# EAGLE design rev10 (EAGLE 7.5.0)
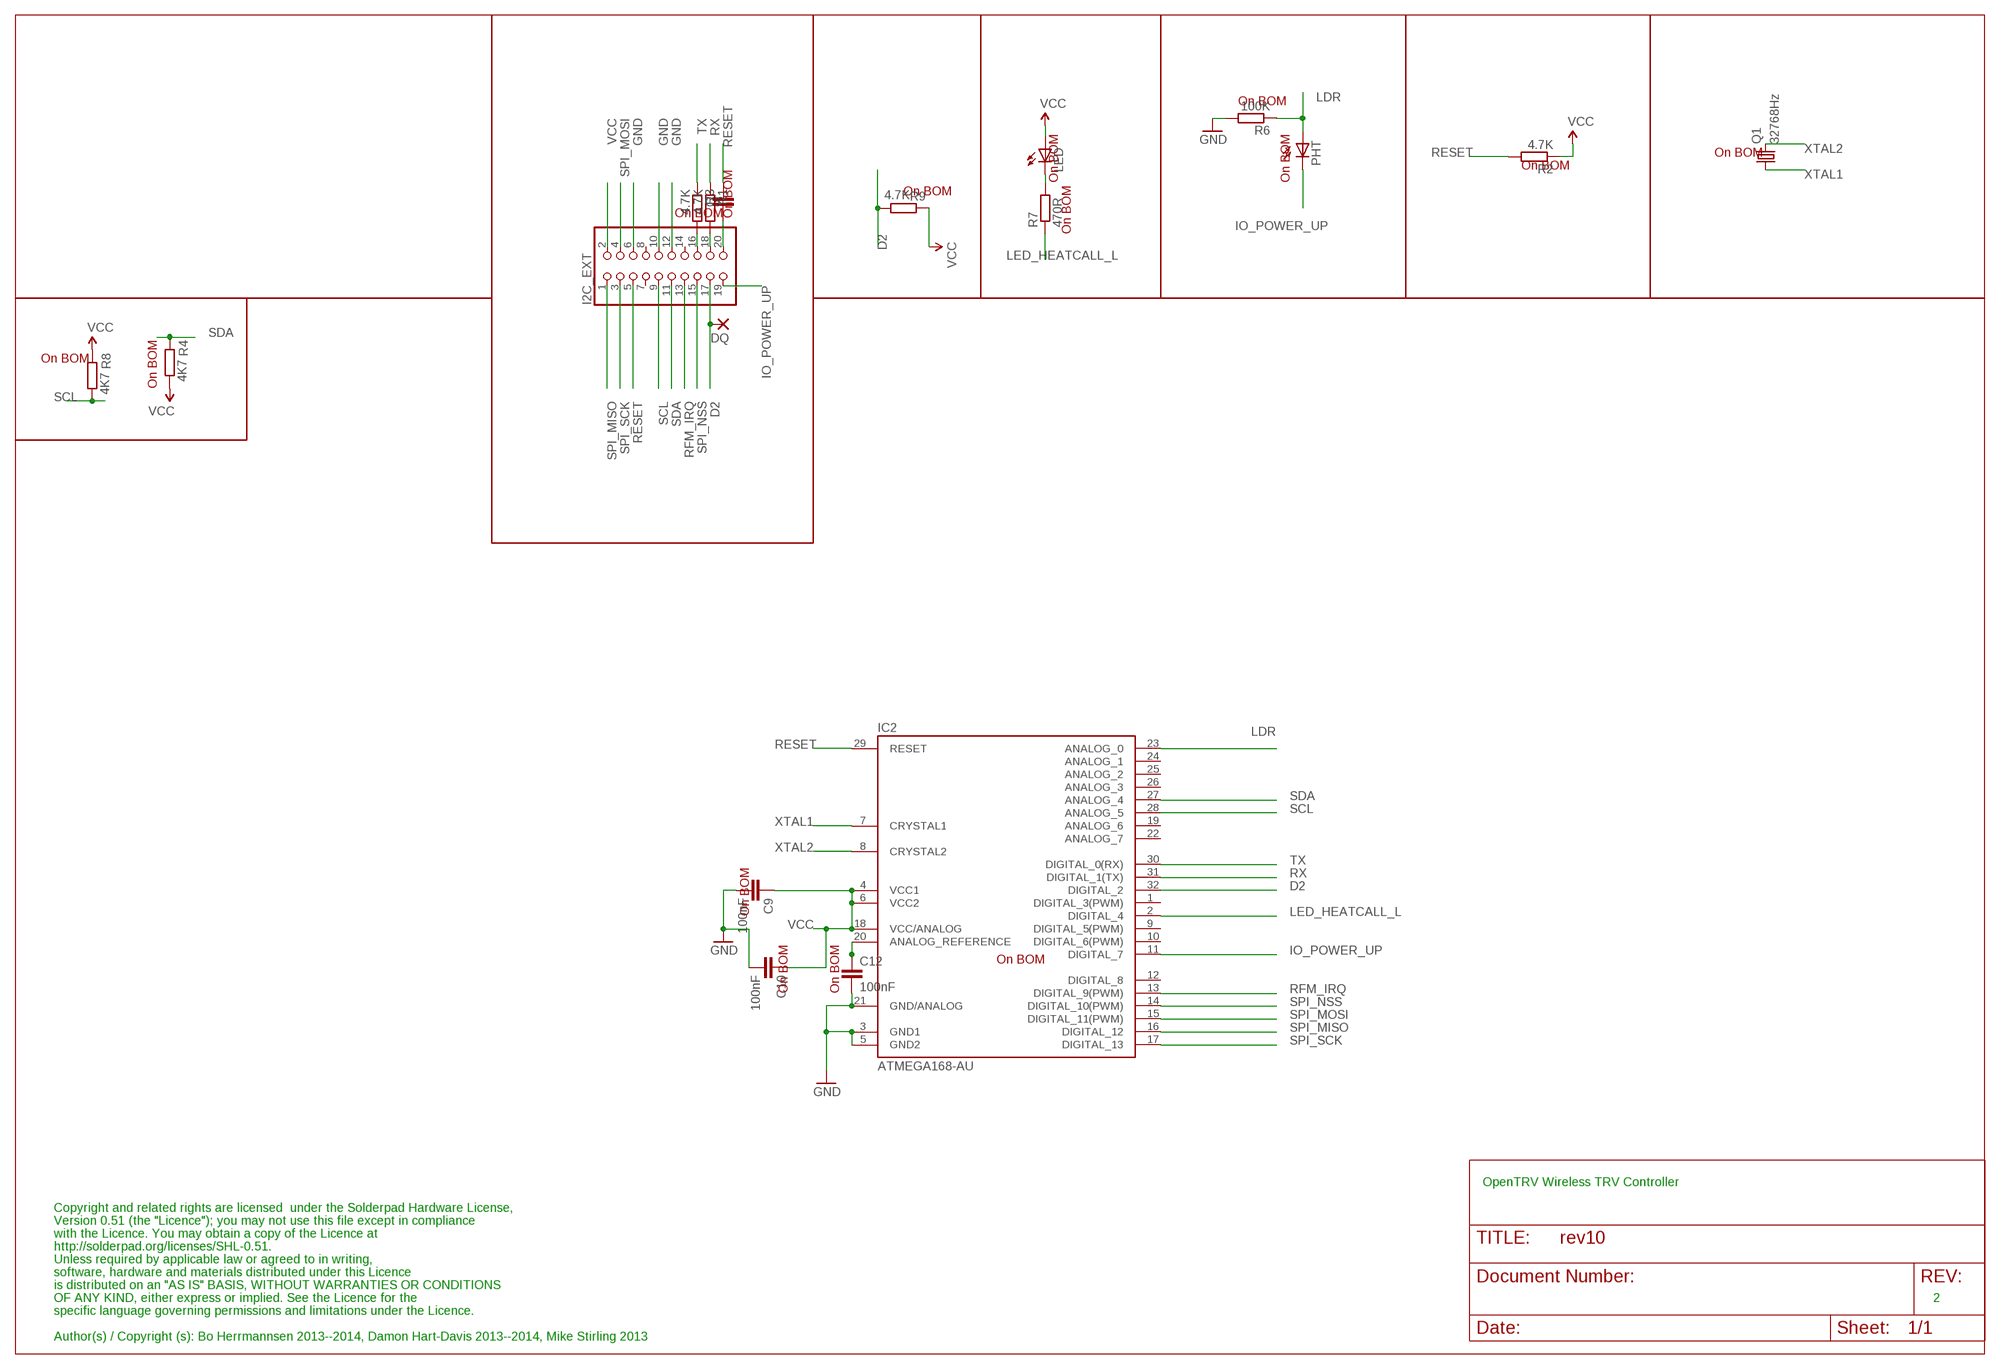
[diagram p0: schematic, sheet 1]

## Parts
C5  100nF  C-EUC0603  [C0603]
C9  100nF  C-EUC0603  [C0603]
C10  100nF  C-EUC0603  [C0603]
C12  100nF  C-EUC0603  [C0603]
DQ  2,15/1,0  [2,15/1,0]
I2C_EXT  PINHD-2X10  [2X10]
IC2  ATMEGA168-AU  [TQFP32-08]
LED  LEDCHIP-LED0603  [CHIP-LED0603]
PHT  BPX65  [BPX65]
Q1  32768Hz  MC-306  [MC-306]
R1  4.7K  R-EU_R0603  [R0603]
R2  4.7K  R-EU_R0603  [R0603]
R3  4.7K  R-EU_R0603  [R0603]
R4  4K7  R-EU_R0603  [R0603]
R6  100K  R-EU_R0603  [R0603]
R7  470R  R-EU_R0603  [R0603]
R8  4K7  R-EU_R0603  [R0603]
R9  4.7K  R-EU_R0603  [R0603]

## Nets
D2: DQ.1(P) I2C_EXT.17 IC2.32(DIGITAL_2) R9.1
GND [supply]: C9.2 C10.2 C12.2 I2C_EXT.6 I2C_EXT.10 I2C_EXT.12 IC2.3(GND1) IC2.5(GND2) IC2.21(GND/ANALOG) R6.2
IO_POWER_UP [supply]: I2C_EXT.19 IC2.11(DIGITAL_7) PHT.K(C)
LDR: IC2.23(ANALOG_0) PHT.A R6.1
LED_HEATCALL_L: IC2.2(DIGITAL_4) R7.1
N$6 [supply]: C12.1 IC2.20(ANALOG_REFERENCE)
N$13: LED.C R7.2
N$24: I2C_EXT.18 R1.2
N$25: I2C_EXT.16 R3.2
N$26: C5.2 I2C_EXT.20
RESET: C5.1 I2C_EXT.5 IC2.29(RESET) R2.2
RFM_IRQ: I2C_EXT.13 IC2.13(DIGITAL_9(PWM))
RX: IC2.31(DIGITAL_1(TX)) R1.1
SCL: I2C_EXT.9 IC2.28(ANALOG_5) R8.1
SDA: I2C_EXT.11 IC2.27(ANALOG_4) R4.2
SPI_MISO: I2C_EXT.1 IC2.16(DIGITAL_12)
SPI_MOSI: I2C_EXT.4 IC2.15(DIGITAL_11(PWM))
SPI_NSS: I2C_EXT.15 IC2.14(DIGITAL_10(PWM))
SPI_SCK: I2C_EXT.3 IC2.17(DIGITAL_13)
TX: IC2.30(DIGITAL_0(RX)) R3.1
VCC [supply]: C9.1 C10.1 I2C_EXT.2 IC2.4(VCC1) IC2.6(VCC2) IC2.18(VCC/ANALOG) LED.A R2.1 R4.1 R8.2 R9.2
XTAL1: IC2.7(CRYSTAL1) Q1.1
XTAL2: IC2.8(CRYSTAL2) Q1.4
Unconnected: I2C_EXT.7 I2C_EXT.8 I2C_EXT.14 IC2.1(DIGITAL_3(PWM)) IC2.9(DIGITAL_5(PWM)) IC2.10(DIGITAL_6(PWM)) IC2.12(DIGITAL_8) IC2.19(ANALOG_6) IC2.22(ANALOG_7) IC2.24(ANALOG_1) IC2.25(ANALOG_2) IC2.26(ANALOG_3)

## Notes on the sheet
- On BOM
- On BOM
- On BOM | On BOM
- On BOM | On BOM
- On BOM
- On BOM
- On BOM
- On BOM
- On BOM
- On BOM
- On BOM
- On BOM | On BOM
- OpenTRV Wireless TRV Controller
- Copyright and related rights are licensed  under the Solderpad Hardware License,
- Version 0.51 (the "Licence"); you may not use this file except in compliance
- with the Licence. You may obtain a copy of the Licence at
- http://solderpad.org/licenses/SHL-0.51.
- Unless required by applicable law or agreed to in writing,
- software, hardware and materials distributed under this Licence
- is distributed on an "AS IS" BASIS, WITHOUT WARRANTIES OR CONDITIONS
- OF ANY KIND, either express or implied. See the Licence for the | 2
- specific language governing permissions and limitations under the Licence.
- Author(s) / Copyright (s): Bo Herrmannsen 2013--2014, Damon Hart-Davis 2013--2014, Mike Stirling 2013

## Library data of the parts
C5 C9 C10 C12 = resistor:C-EU: CAPACITOR, European symbol
DQ = wirepad:2,15/1,0: THROUGH-HOLE PAD
I2C_EXT = pinhead:PINHD-2X10: PIN HEADER
IC2 = Arduino-AVR:ATMEGA168
LED = led:LED: LED OSRAM: - CHIPLED LG R971, LG N971, LY N971, LG Q971, LY Q971, LO R971, LY R971 LH N974, LH R974 LS Q976, LO Q976, LY Q976 LO Q996 - Hyper CHIPLED LW Q18S LB Q993, LB Q99A, LB R99A - SideLED LS A670, LO A670, LY A670, LG A670, LP A670 LB A673, LV A673, LT A673, LW A673 LH A674 LY A675 LS A676, LA A676, LO A676, LY A676, LW A676 LS A679, LY A679, LG A679 - Hyper Micro SIDELED® LS Y876, LA Y876, LO Y876, LY Y876 LT Y87S - SmartLED LW L88C, LW L88S LB L89C, LB L89S, LG L890 LS L89K, LO L89K, LY L89K LS L896, LA L896, LO L896, LY L896 - TOPLED LS T670, LO T670, LY T670, LG T670, LP T670 LSG T670, LSP T670, LSY T670, LOP T670, LYG T670 LG T671, LOG T671, LSG T671 LB T673, LV T673, LT T673, LW T673 LH T674 LS T676, LA T676, LO T676, LY T676, LB T676, LH T676, LSB T676, LW T676 LB T67C, LV T67C, LT T67C, LS T67K, LO T67K, LY T67K, LW E67C LS E67B, LA E67B, LO E67B, LY E67B, LB E67C, LV E67C, LT E67C LW T67C LS T679, LY T679, LG T679 LS T770, LO T770, LY T770, LG T770, LP T770 LB T773, LV T773, LT T773, LW T773 LH T774 LS E675, LA E675, LY E675, LS T675 LS T776, LA T776, LO T776, LY T776, LB T776 LHGB T686 LT T68C, LB T68C - Hyper Mini TOPLED® LB M676 - Mini TOPLED Santana® LG M470 LS M47K, LO M47K, LY M47K Source: http://www.osram.convergy.de LUXEON: - LUMILED® LXK2-PW12-R00, LXK2-PW12-S00, LXK2-PW14-U00, LXK2-PW14-V00 LXK2-PM12-R00, LXK2-PM12-S00, LXK2-PM14-U00 LXK2-PE12-Q00, LXK2-PE12-R00, LXK2-PE12-S00, LXK2-PE14-T00, LXK2-PE14-U00 LXK2-PB12-K00, LXK2-PB12-L00, LXK2-PB12-M00, LXK2-PB14-N00, LXK2-PB14-P00, LXK2-PB14-Q00 LXK2-PR12-L00, LXK2-PR12-M00, LXK2-PR14-Q00, LXK2-PR14-R00 LXK2-PD12-Q00, LXK2-PD12-R00, LXK2-PD12-S00 LXK2-PH12-R00, LXK2-PH12-S00 LXK2-PL12-P00, LXK2-PL12-Q00, LXK2-PL12-R00 Source: www.luxeon.com KINGBRIGHT: KA-3528ASYC Source: www.kingbright.com
PHT = opto-trans-siemens:BPX65: PHOTO DIODE; MPN: BPX65.; OC_FARNELL: 327451; OC_NEWARK: 06WX2764
Q1 = crystal:MC-306: kHz RANGE CRYSTAL UNIT SMD Source: MC-306_405_406_E07X.PDF Homepage <http://www.epsontoyocom.co.jp>; MPN: MC-306 60.0KHZ 100PPM ,12.5PF; OC_FARNELL: 1278040; OC_NEWARK: 31M5576
R1-R4 R6-R9 = resistor:R-EU_: RESISTOR, European symbol

## Net classes
0 default: width 0.203 mm
1 supply: width 0.406 mm, clearance 0.203 mm
2 ant: width 2.184 mm

## Board
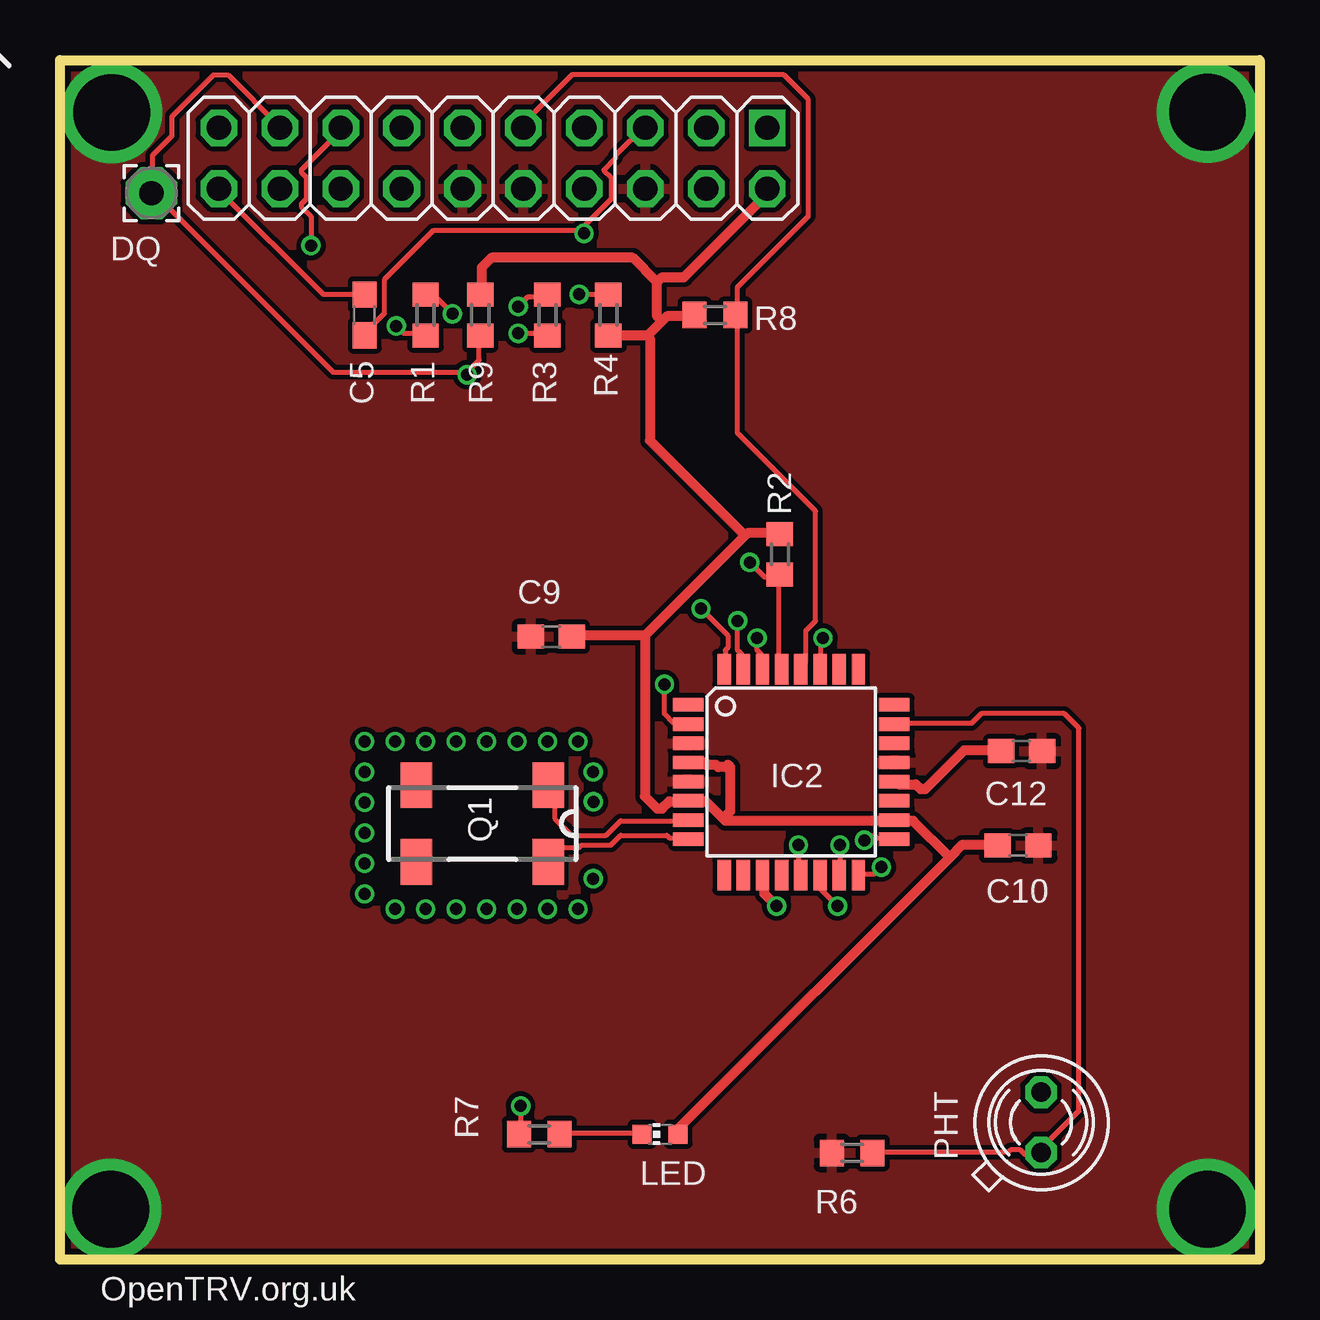
[diagram p1: board, top side]
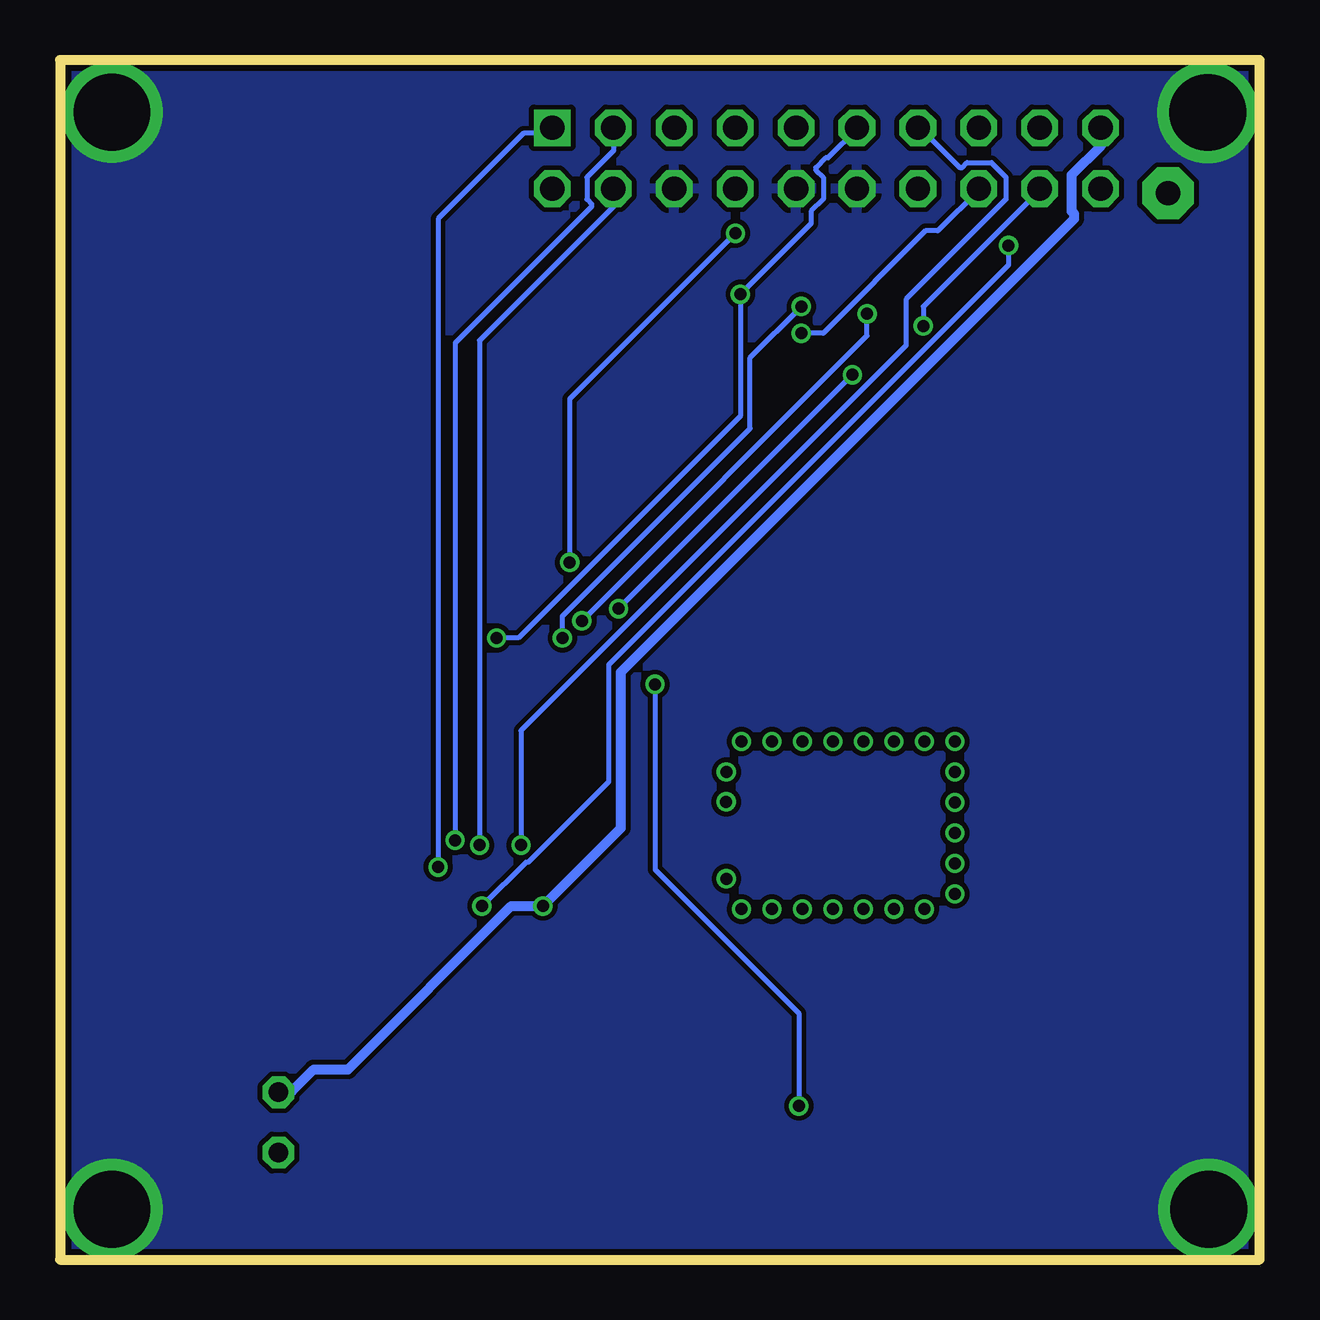
[diagram p2: board, bottom side, seen from below]

Size 50 x 50 mm. Coordinates in mm from the lower left corner, seen from the top.
Outline: 0,0 0,50 50,50 50,0 0,0
Copper layers (1*16): Top 0.035mm / dielectric 1.5mm / Bottom 0.035mm
Design rules "PMServicesStd *": minimum track width 8mil, minimum drill 0.5mm, track to track 8mil, track to pad 8mil, pad to pad 8mil, via to via 8mil, smd to smd 0mil, copper to edge 10mil, drill to drill 10mil, minimum pad ring 10mil, minimum via ring 6mil, stop-mask expansion 2mil, vias tented up to drill 100mil, thermal gap 10mil

### Footprints (pad centres in the part's own frame; a part is rotated, then mirrored left to right if it is on the bottom)
C0603 = smd 1.1 x 1: 1 -0.85,0; 2 0.85,0
2,15/1,0 = drill 1.016 pad 2.159 octagon: 1 0,0
2X10 = drill 1.016 square: 1 -11.43,-1.27 | drill 1.016 octagon: 2 -11.43,1.27; 3 -8.89,-1.27; 4 -8.89,1.27; 5 -6.35,-1.27; 6 -6.35,1.27; 7 -3.81,-1.27; 8 -3.81,1.27; 9 -1.27,-1.27; 10 -1.27,1.27; 11 1.27,-1.27; 12 1.27,1.27; 13 3.81,-1.27; 14 3.81,1.27; 15 6.35,-1.27; 16 6.35,1.27; 17 8.89,-1.27; 18 8.89,1.27; 19 11.43,-1.27; 20 11.43,1.27
TQFP32-08 = smd 1.27 x 0.559: 1 -4.293,2.8; 2 -4.293,2; 3 -4.293,1.2; 4 -4.293,0.4; 5 -4.293,-0.4; 6 -4.293,-1.2; 7 -4.293,-2; 8 -4.293,-2.8; 17 4.293,-2.8; 18 4.293,-2; 19 4.293,-1.2; 20 4.293,-0.4; 21 4.293,0.4; 22 4.293,1.2; 23 4.293,2; 24 4.293,2.8 | smd 0.559 x 1.27: 9 -2.8,-4.293; 10 -2,-4.293; 11 -1.2,-4.293; 12 -0.4,-4.293; 13 0.4,-4.293; 14 1.2,-4.293; 15 2,-4.293; 16 2.8,-4.293; 25 2.8,4.293; 26 2,4.293; 27 1.2,4.293; 28 0.4,4.293; 29 -0.4,4.293; 30 -1.2,4.293; 31 -2,4.293; 32 -2.8,4.293
CHIP-LED0603 = smd 0.8 x 0.8: A 0,-0.75; C 0,0.75
BPX65 = drill 0.813 octagon: A -0.889,-0.889; K 0.889,0.889
MC-306 = smd 1.3 x 1.9: 1 -2.75,-1.6; 2 2.75,-1.6; 3 2.75,1.6; 4 -2.75,1.6
R0603 = smd 1 x 1.1: 1 -0.85,0; 2 0.85,0

### Placement (x,y rotation side)
C5  12.7,39.37 90 top
C9  20.48,25.97 180 top
C10  39.93,17.26 0 top
C12  40.08,21.19 0 top
DQ  3.81,44.45 0 top
I2C_EXT  18.05,45.91 180 top
IC2  30.48,20.32 0 top
LED  25.02,5.22 90 top
PHT  40.89,5.71 45 top
Q1  17.6,18.17 180 top
R1  15.24,39.37 270 top
R2  30.01,29.4 270 top
R3  20.32,39.37 270 top
R4  22.86,39.37 90 top
R6  33.02,4.45 180 top
R7  19.98,5.22 0 top
R8  27.3,39.37 180 top
R9  17.52,39.37 90 top
U$1  [OSHW_10X200_NOTEXT]  -10.73,16.03 0 top  (outside the outline)
U$2  [TONNE]  -9.03,53.76 0 top  (outside the outline)

### Tracks (layer width: path | path; a pad name or v marks a point on that pad's centre or on a via)
D2  (via drill 0.5)
  Top 0.203: 16.97,36.98 17.48,37.49 17.48,38.51 R9.1 | 16.97,36.98 11.38,36.98 3.86,44.5 | v26.72,27.13 27.84,26.01 27.84,25.5 27.74,25.4 27.74,24.69 IC2.32 | 16.97,36.98 v16.97,36.88 | 3.86,44.5 3.86,46.02 4.67,46.84 4.67,47.65 6.4,49.38 7.01,49.38 9.14,47.24 I2C_EXT.17 | 3.86,44.5 DQ.1
  Bottom 0.203: v16.97,36.88 v26.72,27.13
GND  (via drill 3.2)
  other vias: 2.16,47.81 47.83,47.82 47.83,2.1 2.11,2.1
  pour Bottom: 0,50 0,0 50,0 50,50
  pour Top: 0,50 0,0 50,0 50,50
IO_POWER_UP  (via drill 0.5)
  Top 0.406: v29.87,14.73 29.36,15.24 29.36,15.95 IC2.11
  Bottom 0.406: PHT.K 40.84,7.01 40.34,7.01 39.42,7.92 38,7.92 31.19,14.73 v29.87,14.73 26.62,17.98 26.62,24.49 7.72,43.38 7.72,43.59 7.82,43.69 7.82,45.21 6.6,46.43 6.6,47.14 I2C_EXT.19
LDR
  Top 0.203: R6.1 33.93,4.47 39.52,4.47 39.62,4.57 40.03,4.57 40.23,4.37 40.84,4.37 PHT.A 40.95,4.47 40.95,4.67 42.47,6.2 42.47,22.15 41.86,22.76 38.41,22.76 38,22.35 34.85,22.35 IC2.23
LED_HEATCALL_L  (via drill 0.5)
  Top 0.203: v19.2,6.4 19.2,5.28 R7.1 | v25.2,23.98 25.2,22.76 25.6,22.35 26.11,22.35 IC2.2
  Bottom 0.203: v19.2,6.4 19.2,10.26 25.2,16.26 v25.2,23.98
N$6
  Top 0.406: C12.1 39.22,21.23 37.69,21.23 36.07,19.61 35.87,19.61 35.66,19.81 34.95,19.81 34.85,19.91 IC2.20
N$13
  Top 0.203: LED.C 24.18,5.28 20.93,5.28 R7.2
N$24  (via drill 0.5)
  Top 0.203: v14.02,38.91 14.33,38.61 15.24,38.61 R1.2
  Bottom 0.203: v14.02,38.91 14.02,39.73 9.14,44.6 I2C_EXT.18
N$25  (via drill 0.5)
  Top 0.203: v19.1,38.61 20.32,38.61 R3.2
  Bottom 0.203: v19.1,38.61 18.19,38.61 13.92,42.88 13.41,42.88 11.68,44.6 I2C_EXT.16
N$26
  Top 0.203: C5.2 12.7,40.23 10.97,40.23 6.6,44.6 I2C_EXT.20
N$28  (via drill 0.5)
  other vias: 22.23,15.88
N$33  (via drill 0.5)
  other vias: 20.32,14.61
N$34  (via drill 0.5)
  other vias: 21.59,21.59
N$35  (via drill 0.5)
  other vias: 12.7,16.51
N$36  (via drill 0.5)
  other vias: 12.7,15.24
N$37  (via drill 0.5)
  other vias: 13.97,14.61
N$38  (via drill 0.5)
  other vias: 15.24,14.61
N$39  (via drill 0.5)
  other vias: 16.51,14.61
N$40  (via drill 0.5)
  other vias: 17.78,14.61
N$41  (via drill 0.5)
  other vias: 19.05,14.61
N$42  (via drill 0.5)
  other vias: 12.7,17.78
N$43  (via drill 0.5)
  other vias: 12.7,19.05
N$44  (via drill 0.5)
  other vias: 12.7,20.32
N$45  (via drill 0.5)
  other vias: 12.7,21.59
N$46  (via drill 0.5)
  other vias: 13.97,21.59
N$47  (via drill 0.5)
  other vias: 15.24,21.59
N$48  (via drill 0.5)
  other vias: 16.51,21.59
N$49  (via drill 0.5)
  other vias: 17.78,21.59
N$50  (via drill 0.5)
  other vias: 19.05,21.59
N$51  (via drill 0.5)
  other vias: 20.32,21.59
N$52  (via drill 0.5)
  other vias: 21.59,14.61
N$53  (via drill 0.5)
  other vias: 22.23,20.32
N$54  (via drill 0.5)
  other vias: 22.23,19.08
RESET  (via drill 0.5)
  Top 0.203: IC2.29 30.07,24.69 29.97,24.79 29.97,28.45 R2.2 29.87,28.45 29.36,28.45 v28.75,29.06 | 21.69,42.93 22.96,44.2 22.96,45.11 22.66,45.41 23.16,45.92 23.16,46.02 24.38,47.24 I2C_EXT.5 | 21.69,42.93 21.64,42.88 15.54,42.88 13.51,40.84 13.51,39.42 12.7,38.61 C5.1 | 21.69,42.93 v21.84,42.77
  Bottom 0.203: v28.75,29.06 28.75,35.87 v21.84,42.77
RFM_IRQ  (via drill 0.5)
  Top 0.203: v30.79,17.27 30.79,16.05 IC2.13
  Bottom 0.203: v30.79,17.27 30.79,22.05 14.73,38.1 14.73,40.03 10.57,44.2 10.57,45.11 11.18,45.72 12.19,45.72 12.39,45.52 12.5,45.52 14.22,47.24 I2C_EXT.13
RX  (via drill 0.5)
  Top 0.203: v16.36,39.42 15.65,40.13 15.24,40.13 R1.1 | v28.25,26.62 28.25,25.4 28.45,25.2 28.45,24.69 IC2.31
  Bottom 0.203: v16.36,39.42 16.36,38.51 v28.25,26.62
SCL
  Top 0.203: IC2.28 30.89,24.69 31.09,24.89 31.09,26.21 31.5,26.62 31.5,31.19 28.25,34.44 28.25,39.32 R8.1 28.25,39.42 28.25,40.54 31.19,43.48 31.19,48.36 30.18,49.38 21.34,49.38 19.41,47.45 19.41,47.24 I2C_EXT.9
SDA  (via drill 0.5)
  Top 0.203: v21.64,40.23 22.86,40.23 R4.2 | v31.8,25.91 31.7,25.81 31.7,24.69 IC2.27
  Bottom 0.203: I2C_EXT.11 16.76,47.14 17.98,45.92 18.09,45.92 18.49,45.52 18.49,45.41 18.19,45.11 18.19,44.2 18.69,43.69 18.69,43.18 v21.64,40.23 21.64,35.15 30.89,25.91 v31.8,25.91
SPI_MISO  (via drill 0.5)
  Top 0.203: v34.24,16.36 33.93,16.05 33.33,16.05 IC2.16
  Bottom 0.203: v34.24,16.36 34.24,43.38 30.68,46.94 29.77,46.94 29.57,47.14 I2C_EXT.1
SPI_MOSI  (via drill 0.5)
  Top 0.203: v32.51,17.27 32.51,16.05 IC2.15
  Bottom 0.203: v32.51,17.27 32.51,38.3 26.92,43.89 26.92,44.6 I2C_EXT.4
SPI_NSS  (via drill 0.5)
  Top 0.203: v32.41,14.73 31.7,15.44 31.7,15.95 IC2.14 | v10.46,42.27 10.46,43.48 10.06,43.89 10.06,43.99 10.26,44.2 10.26,45.11 10.06,45.31 10.06,45.41 11.79,47.14 I2C_EXT.15
  Bottom 0.203: v32.41,14.73 30.58,16.56 30.48,16.56 27.13,19.91 27.13,24.79 10.46,41.45 v10.46,42.27
SPI_SCK  (via drill 0.5)
  Top 0.203: v33.53,17.48 33.73,17.68 33.93,17.68 34.04,17.58 34.75,17.58 IC2.17
  Bottom 0.203: v33.53,17.48 33.53,38.2 27.84,43.89 27.84,43.99 28.04,44.2 28.04,45.11 26.92,46.23 26.92,47.14 I2C_EXT.3
TX  (via drill 0.5)
  Top 0.203: v19.1,39.73 19.51,40.13 20.32,40.13 R3.1 | v29.06,25.91 29.06,25.4 29.26,25.2 29.26,24.69 IC2.30
  Bottom 0.203: v19.1,39.73 21.23,37.59 21.23,34.65 29.06,26.82 v29.06,25.91
VCC
  Top 0.406: 37.08,16.76 37.59,17.27 39.01,17.27 C10.1 | 37.08,16.76 25.81,5.49 25.81,5.28 LED.A | 37.08,16.76 35.56,18.29 34.85,18.29 IC2.18 34.65,18.29 27.74,18.29 27.64,18.39 | 27.64,18.39 26.92,19.1 26.21,19.1 IC2.6 26.01,19.1 25.4,19.1 25.09,18.8 24.89,18.8 24.38,19.3 24.38,26.01 | 27.64,18.39 27.94,18.69 27.94,20.52 27.84,20.62 27.74,20.52 27.43,20.52 27.33,20.62 26.92,20.62 26.82,20.73 26.21,20.73 IC2.4 | 24.38,26.01 21.34,26.01 C9.1 | 28.55,30.18 28.65,30.28 29.97,30.28 R2.1 | 28.55,30.18 24.38,26.01 | 24.49,38.51 22.86,38.51 R4.1 | 25.09,39.12 25.3,39.32 26.42,39.32 R8.2 | 25.09,39.12 24.49,38.51 | 24.89,40.74 23.88,41.76 17.98,41.76 17.58,41.35 17.58,40.23 R9.2 | 24.89,40.74 24.89,39.32 25.09,39.12 | I2C_EXT.2 29.46,44.6 29.46,44.4 26.01,40.95 25.09,40.95 24.89,40.74 | 28.55,30.18 24.59,34.14 24.59,38.41 24.49,38.51
XTAL1
  Top 0.203: IC2.7 26.11,18.29 23.37,18.29 22.76,17.68 21.34,17.68 20.62,18.39 20.62,19.51 20.42,19.71 Q1.1
XTAL2
  Top 0.203: IC2.8 26.11,17.58 25.4,17.58 25.3,17.68 23.37,17.68 22.96,17.27 21.74,17.27 21.64,17.17 20.93,17.17 20.42,16.66 Q1.4

### Text on the board
bPlace: License: http://goo.gl/3d71UJ
tNames: DQ | 20151208 | OpenTRV.org.uk
bNames: Seal off solderpads with / hotmelt glue or silicone / glue